# Altium schematic sheet GPS.SchDoc
size A; SheetNumber: 1; SheetTotal: 1
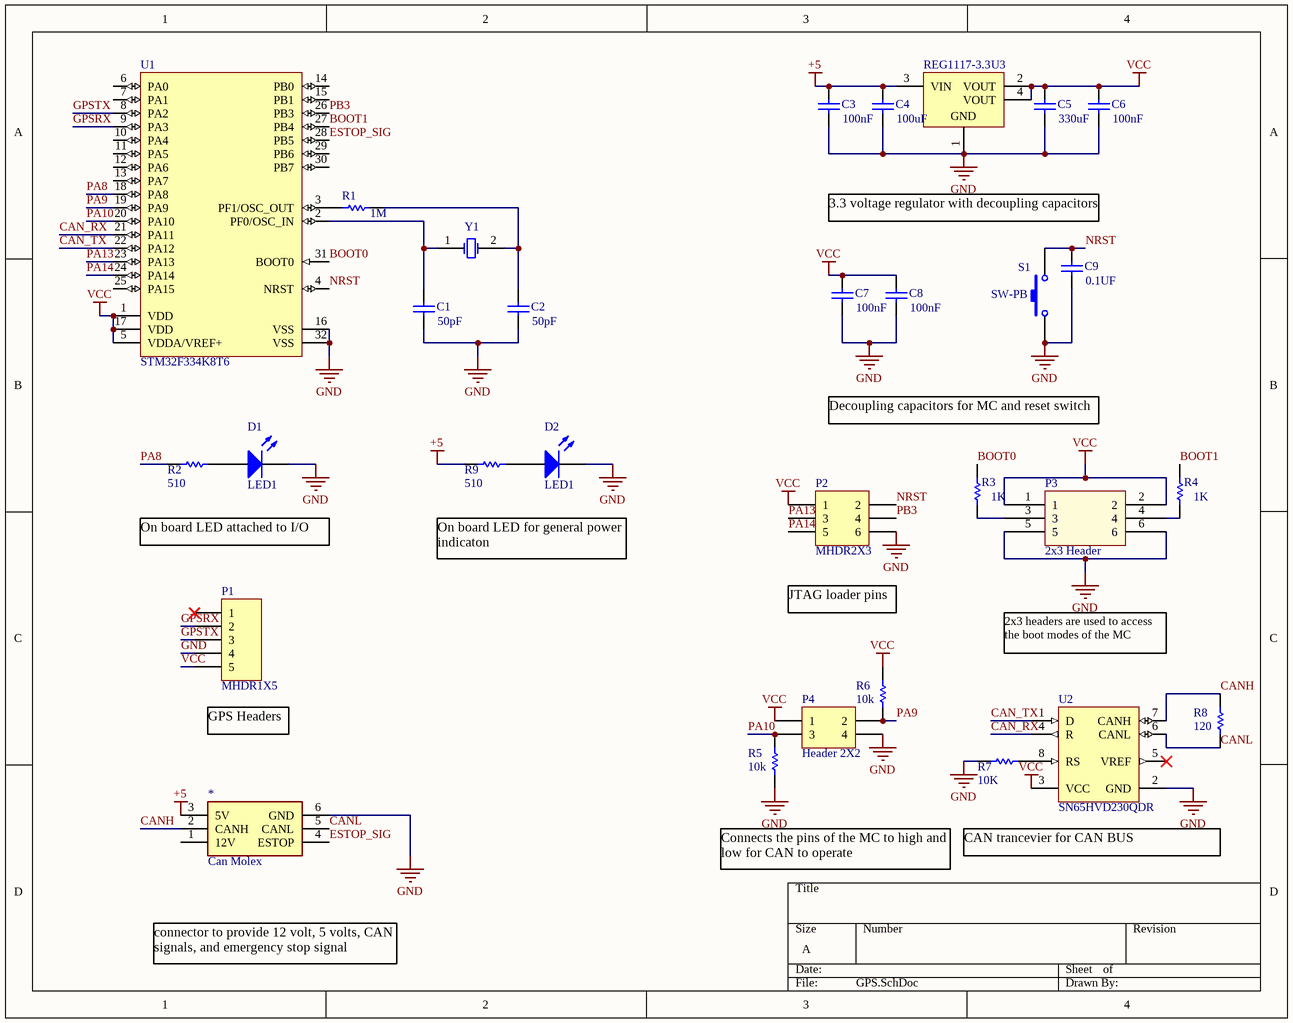
[diagram p0: GPS.SchDoc]

## Parts
*  Can Molex  [Can Molex-Footprint-1]
C1  value 50pF  [6-0805_L]  (hidden comment: Cap)
C2  value 50pF  [6-0805_L]  (hidden comment: Cap)
C3  value 100nF  [6-0805_L]  (hidden comment: Cap)
C4  value 100uF  [6-0805_L]  (hidden comment: Cap)
C5  value 330uF  [6-0805_L]  (hidden comment: Cap)
C6  value 100nF  [6-0805_L]  (hidden comment: Cap)
C7  value 100nF  [6-0805_L]  (hidden comment: Cap)
C8  value 100nF  [6-0805_L]  (hidden comment: Cap)
C9  value 0.1UF  [6-0805_L]  (hidden comment: Cap)
D1  LED1  [6-0805_L]
D2  LED1  [6-0805_L]
P1  MHDR1X5  [MHDR1X5]
P2  MHDR2X3  [HDR2X3]
P3  2x3 Header  [HDR2X3]
P4  Header 2X2  [HDR2X2]
R1  value 1M  [1608[0603]]  (hidden comment: Res1)
R2  value 510  [1608[0603]]  (hidden comment: Res1)
R3  value 1K  [1608[0603]]  (hidden comment: Res1)
R4  value 1K  [1608[0603]]  (hidden comment: Res1)
R5  value 10k  [1608[0603]]  (hidden comment: Res1)
R6  value 10k  [1608[0603]]  (hidden comment: Res1)
R7  value 10K  [1608[0603]]  (hidden comment: Res1)
R8  value 120  [1608[0603]]  (hidden comment: Res1)
R9  value 510  [1608[0603]]  (hidden comment: Res1)
S1  SW-PB  [Push Switch 3x6x2.5]
U1  STM32F334K8T6  [STM-LQFP32_M]
U2  SN65HVD230QDR  [D0008A_L]
U3  REG1117-3.3  [DCY0004A_M]
Y1  XTAL  [Crystal 11.4 x 4.7 x 4.2 mm]  (value not drawn)

## Nets
+5: *.3(5V) C3.2 C4.2 R9.1 U3.3(VIN)
GND: *.6(GND) C1.2 C2.2 C3.1 C4.1 C5.1 C6.1 C7.1 C8.1 C9.1 D1.2(K) D2.2(K) P1.4 P2.6 P3.5 P3.6 P4.4 R5.1 R7.1 S1.1 U1.16(VSS) U1.32(VSS) U2.2(GND) U3.1(GND)
VCC: C5.2 C6.2 C7.2 C8.2 P1.5 P2.1 P3.1 P3.2 P4.1 R6.2 U1.1(VDD) U1.5(VDDA/VREF+) U1.17(VDD) U2.3(VCC) U3.2(VOUT) U3.4(VOUT)
BOOT0: R3.2 U1.31(BOOT0)
BOOT1: R4.2 U1.27(PB4)
CAN_RX: U1.21(PA11) U2.4(R)
CAN_TX: U1.22(PA12) U2.1(D)
CANH: *.2(CANH) R8.2 U2.7(CANH)
CANL: *.5(CANL) R8.1 U2.6(CANL)
ESTOP_SIG: *.4(ESTOP) U1.28(PB5)
GPSRX: P1.2 U1.9(PA3)
GPSTX: P1.3 U1.8(PA2)
NRST: C9.2 P2.2 S1.2 U1.4(NRST)
PA8: R2.1 U1.18(PA8)
PA9: P4.2 R6.1 U1.19(PA9)
PA10: P4.3 R5.2 U1.20(PA10)
PA13: P2.3 U1.23(PA13)
PA14: P2.5 U1.24(PA14)
PB3: P2.4 U1.26(PB3)
NetC1_1: C1.1 U1.2(PF0/OSC_IN) Y1.1(OSC1)
NetC2_1: C2.1 R1.2 Y1.2(OSC2)
NetD1_1: D1.1(A) R2.2
NetD2_1: D2.1(A) R9.2
NetP3_3: P3.3 R3.1
NetP3_4: P3.4 R4.1
NetR1_1: R1.1 U1.3(PF1/OSC_OUT)
NetR7_2: R7.2 U2.8(RS)

Not connected (* = marked no-connect by the designer): * 1(12V); P1 1*; U1 6(PA0) 7(PA1) 10(PA4) 11(PA5) 12(PA6) 13(PA7) 14(PB0) 15(PB1) 25(PA15) 29(PB6) 30(PB7); U2 5(VREF)*

## Notes on the sheet
- 3.3 voltage regulator with decoupling capacitors
- Decoupling capacitors for MC and reset switch
- On board LED attached to I/O pin
- On board LED for general power indicaton
- JTAG loader pins
- 2x3 headers are used to access the boot modes of the MC
- (near P1) GPS Headers
- Connects the pins of the MC to high and low for CAN to operate
- (near U2) CAN trancevier for CAN BUS communication
- connector to provide 12 volt, 5 volts, CAN signals, and emergency stop signal

## Library data of the parts
* = CMP-001-0001-2: can molex for IGVC; Datasheet: https://www.mouser.com/datasheet/2/276/0430450612_PCB_HEADERS-142990.pdf; Mouser: https://www.mouser.com/ProductDetail/Molex/43045-0612?qs=KC2ywxza1kqWo9LLJ5Lh3w%3D%3D
C1-C9 = Cap: Capacitor; Published: 8-Jun-2000; LatestRevisionDate: 17-Jul-2002; LatestRevisionNote: Re-released for DXP Platform.; PackageReference: RAD-0.3; Publisher: Altium Limited; PackageDescription: Radial Cap, Thru-Hole; 2 Leads; 0.3 in Pin Spacing
D1 D2 = LED1: Typical RED GaAs LED; Published: 8-Jun-2000; LatestRevisionDate: 08-Jul-2005; LatestRevisionNote: Mech Layer 1 removed.; PackageReference: LED-1; Publisher: Altium Limited; PackageDescription: LED; 2 Leads
P1 = MHDR1X5: Header, 5-Pin; LatestRevisionDate: 17-Jul-2002; LatestRevisionNote: Re-released for DXP Platform.; Publisher: Altium Limited
P2 = MHDR2X3: Header, 3-Pin, Dual row; LatestRevisionDate: 17-Jul-2002; LatestRevisionNote: Re-released for DXP Platform.; Publisher: Altium Limited
P4 = Header 2X2: Header, 2-Pin, Dual row; LatestRevisionDate: 17-Jul-2002; LatestRevisionNote: Re-released for DXP Platform.; Publisher: Altium Limited
R1-R9 = Res1: Resistor; Published: 8-Jun-2000; LatestRevisionDate: 17-Jul-2002; LatestRevisionNote: Re-released for DXP Platform.; PackageReference: AXIAL-0.3; Publisher: Altium Limited; PackageDescription: Axial Device, Thru-Hole; 2 Leads; 0.3 in Pin Spacing
S1 = SW-PB: Switch; Published: 24-Mar-1999; LatestRevisionDate: 17-Jul-2002; LatestRevisionNote: Re-released for DXP Platform.; PackageReference: SPST-2; Publisher: Altium Limited; PackageDescription: Switch; 2 Leads
U1 = CMP-0537-00074-1: ARM Cortex-M4 32-bit MCU, 64 KB Flash, 16 KB Internal RAM, 25 I/Os, 32-Pin LQFP, -40 to 85 degC, Tray; Operating Frequency(F) (Processor speed) (MHz): 72; Supply Voltage(Vcc) min (V): 2; D/A Converter: 3; FLASH Size (Prog) (kB): 64; I/Os (High Current): 25; Internal RAM Size (kB): 16; ComponentLink1URL: http://www.st.com/; Package Reference: LQFP32; ComponentLink1Description: Manufacturer URL; Packing: Tray; ComponentLink2Description: Datasheet; Core: ARM Cortex-M4; Package Description: 32-Pin Low Profile Quad Flat Package, 7 x 7 mm Body, 0.8 mm Pitch; DatasheetVersion: Rev. 4; ComponentLink2URL: http://www.st.com/st-web-ui/static/active/en/resource/technical/document/datasheet/DM00097745.pdf; Mounting Technology: Surface Mount
U2 = CMP-0315-00033-2: Automotive Catalog 3.3 V CAN Transceiver, 17 mA, 3.3 V, -40 to 125 degC, 8-pin SOIC (D), Green (RoHS & no Sb/Br); Manufacturer: Texas Instruments; Transient Pulse Protection(V): -25 to 25; Receivers Per Package: 1; ICC(Max)(mA): 17; Supply Voltage(s)(V): 3.3; PackageDescription: 8-Pin Plastic Small Outline Integrated Circuit, 4.9 x 3.9 mm, Pitch 1.27 mm Pitch; Isolated: No; PackageReference: D0008A; SubFamily: CAN; PartNumber: SN65HVD230QDR; Footprint: PCA82C250; DatasheetVersion: SLOS346K; Drivers Per Package: 1; ComponentLink1URL: http://www.ti.com/lit/ds/symlink/sn65hvd230.pdf; PackageVersion: revM, Jun-2011; Code_JEDEC: MS-012AA; Rating: Catalog; Eco-Plan: Green (RoHS & no Sb/Br); ComponentLink1Description: Datasheet; Mounting Technology: Surface Mount
U3 = CMP-0395-00549-2: Single Output LDO, 800 mA, Fixed 3.3 V Output, 3.8 to 15 V Input, with Internal Current Limiting, 4-pin SOT-223 (DCY), -40 to 125 degC, Green (RoHS & no Sb/Br); Manufacturer: Texas Instruments; Vout Adj(Max)(V): 3.3; Vin(Max)(V): 15; Iq(Typ)(mA): 4; Iout(Max)(A): 0.8; Vdo(Typ)(mV): 1100; Vin(Min)(V): 3.8; SubFamily: Single Channel LDO; Rating: Catalog; Fixed Output Options(V): 5; ComponentLink1Description: Manufacturer URL; Eco-Plan: Green (RoHS & no Sb/Br); PackageReference: DCY0004A; Mounting Technology: Surface Mount; ComponentLink3Description: Package Specification; Vout Adj(Min)(V): 3.3; ComponentLink2URL: http://www.ti.com/general/docs/lit/getliterature.tsp?genericPartNumber=REG1117-33&fileType=pdf; PackageVersion: 4202506/B; ComponentLink3URL: http://www.ti.com/litv/pdf/mpds094a; Code_JEDEC: TO-261; ComponentLink1URL: http://www.ti.com/; ComponentLink2Description: Datasheet; PartNumber: REG1117-3.3; DatasheetVersion: SBVS001D; PackageDescription: 4-Pin Plastic Small Outline, Body 3.5 x 6.5 mm, Pitch 2.3 mm
Y1 = XTAL: Crystal Oscillator; Published: 8-Jun-2000; LatestRevisionDate: 17-Jul-2002; LatestRevisionNote: Re-released for DXP Platform.; PackageReference: R38; Publisher: Altium Limited; PackageDescription: Crystal, Thru-Hole; 2 Leads; Body 3.1 x 8.2 mm (Dia.xH)